# EAGLE schematic Mini Project - Schematic - Multilevel Power Supply (EAGLE 9.6.2)
DRAWING_AUTHOR: Santos, Canoneo, Villegas - BSCOE 2-1
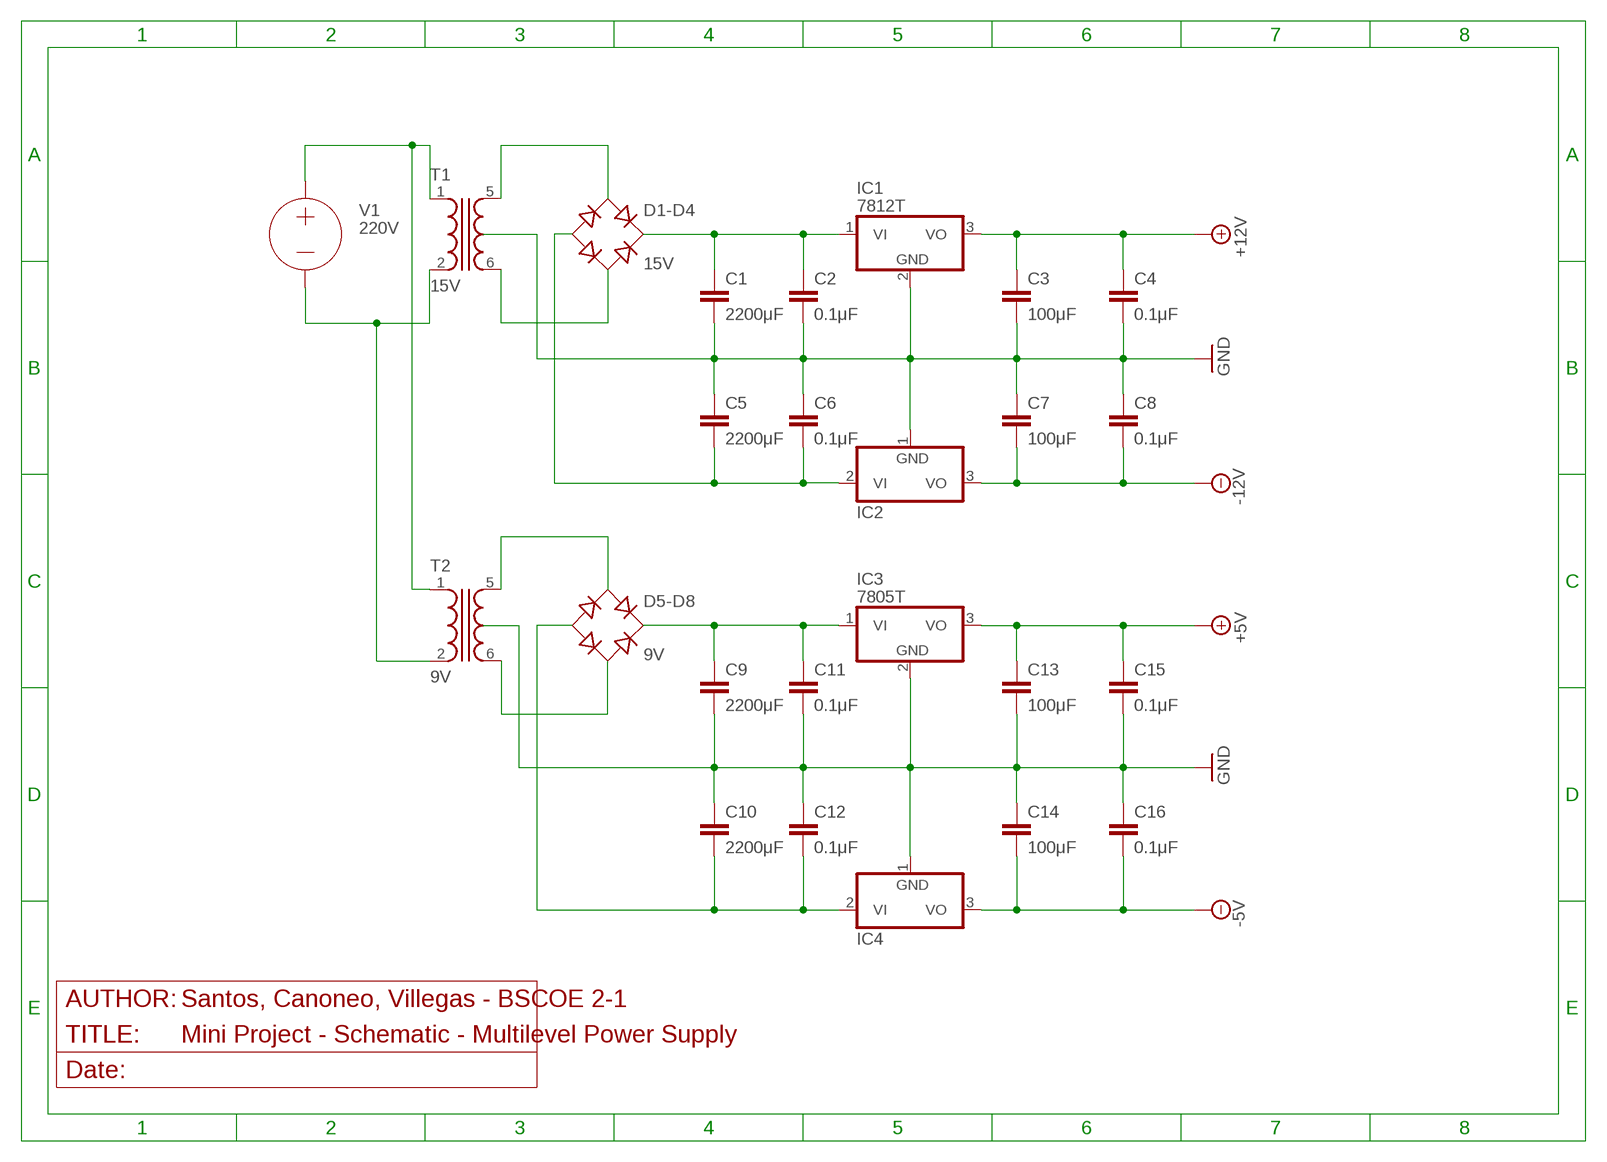
[diagram p0: schematic, sheet 1]

## Parts
C1  2200μF  C-EU025-024X044  [C025-024X044]
C2  0.1μF  C-EU025-024X044  [C025-024X044]
C3  100μF  C-EU025-024X044  [C025-024X044]
C4  0.1μF  C-EU025-024X044  [C025-024X044]
C5  2200μF  C-EU025-024X044  [C025-024X044]
C6  0.1μF  C-EU025-024X044  [C025-024X044]
C7  100μF  C-EU025-024X044  [C025-024X044]
C8  0.1μF  C-EU025-024X044  [C025-024X044]
C9  2200μF  C-EU025-024X044  [C025-024X044]
C10  2200μF  C-EU025-024X044  [C025-024X044]
C11  0.1μF  C-EU025-024X044  [C025-024X044]
C12  0.1μF  C-EU025-024X044  [C025-024X044]
C13  100μF  C-EU025-024X044  [C025-024X044]
C14  100μF  C-EU025-024X044  [C025-024X044]
C15  0.1μF  C-EU025-024X044  [C025-024X044]
C16  0.1μF  C-EU025-024X044  [C025-024X044]
D1-D4  15V  MB1S  [SOIC-4]
D5-D8  9V  MB2S  [SOIC-4]
IC1  7812T  [TO220H]
IC2  7912T  [TO220H]
IC3  7805T  [TO220H]
IC4  7905T  [TO220H]
T1  15V  XFORMER  [T70-E]
T2  9V  XFORMER  [T70-E]
V1  220V  VOLTAGE  (no package)

## Nets
+5V: C13.1 C15.1 IC3.3(VO)
+12V: C3.1 C4.1 IC1.3(VO)
-5V: C14.2 C16.2 IC4.3(VO)
-12V: C7.2 C8.2 IC2.3(VO)
GND: C1.2 C2.2 C3.2 C4.2 C5.1 C6.1 C7.1 C8.1 C9.2 C10.1 C11.2 C12.1 C13.2 C14.1 C15.2 C16.1 IC1.2(GND) IC2.1(GND) IC3.2(GND) IC4.1(GND)
N$1: T1.1 T2.1 V1.+
N$2: T1.2 T2.2 V1.-
N$3: D1-D4.~1(AC1) T1.5(S1)
N$4: D1-D4.~2(AC2) T1.6(S2)
N$5: C1.1 C2.1 D1-D4.+ IC1.1(VI)
N$6: C5.2 C6.2 D1-D4.- IC2.2(VI)
N$7: D5-D8.~1(AC1) T2.5(S1)
N$8: D5-D8.~2(AC2) T2.6(S2)
N$10: C9.1 C11.1 D5-D8.+ IC3.1(VI)
N$12: C10.2 C12.2 D5-D8.- IC4.2(VI)
Unconnected: T1.3(P1) T1.4(P2) T1.7(S1) T1.8(S2) T2.3(P1) T2.4(P2) T2.7(S1) T2.8(S2)

## Library data of the parts
C1-C16 = rcl:C-EU: CAPACITOR, European symbol; SPICEPREFIX: C
D1-D4 D5-D8 = rectifier:MB*S: Bridge Rectifier Source: http://www.fairchildsemi.com/ds/MB/MB6S.pdf
IC1 IC3 = linear:78*: Positive VOLTAGE REGULATOR Source: http://cache.national.com/ds/LM/LM78L05.pdf http://www.fairchildsemi.com/ds/LM/LM7805.pdf
IC2 IC4 = linear:79*: Negative VOLTAGE REGULATOR
T1 T2 = special:XFORMER: TRANSFORMER 2 x primary, 2 x secondary
V1 = ngspice-simulation:VOLTAGE: Independent Voltage Source, either DC, AC, PULSE, SINE, PWL, EXP, or SFFM; VALUE: 0V